# Altium schematic sheet DEBUG.SchDoc
size A4
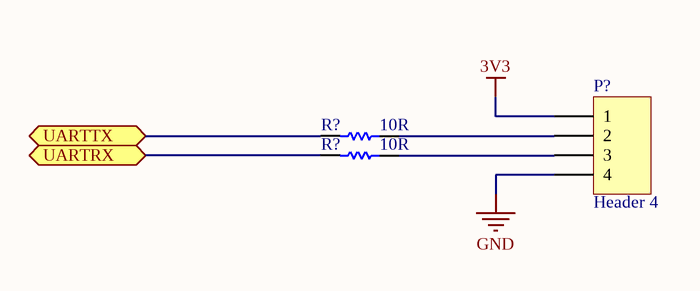
[diagram p0: DEBUG.SchDoc]

## Parts
(Parts that share a designator on the sheet are numbered #1, #2 ... from top to bottom, then left to right.)
P?  Header 4  [HDR1X4]
R?#1  value 10R  [RESC1608L]  (hidden comment: RES0603-100K)
R?#2  value 10R  [RESC1608L]  (hidden comment: RES0603-100K)

## Ports
UARTRX, UARTTX

## Nets
3V3: P?.1
GND: P?.4
UARTRX: R?#2.2 ; port UARTRX
UARTTX: R?#1.2 ; port UARTTX
NetP?_2: P?.2 R?#1.1
NetP?_3: P?.3 R?#2.1

## Library data of the parts
P? = Header 4: Header, 4-Pin; LatestRevisionDate: 17-Jul-2002; LatestRevisionNote: Re-released for DXP Platform.; Publisher: Altium Limited
R?#1 R?#2 = Res Semi: Semiconductor Resistor; Published: 8-Jun-2000; LatestRevisionDate: 17-Jul-2002; LatestRevisionNote: Re-released for DXP Platform.; PackageReference: AXIAL-0.5; Publisher: Altium Limited